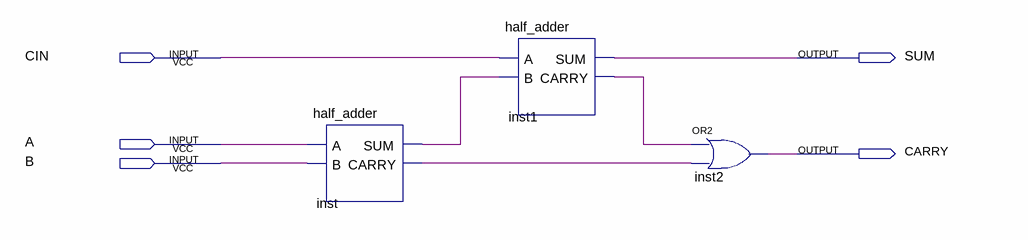
[diagram p0: schematic sheet]
// Quartus schematic full_adder.bdf as structural Verilog: 3 symbols, 5 pins
module full_adder (
  input  CIN,
  input  A,
  input  B,
  output SUM,
  output CARRY
);

  wire inst1_carry, inst_carry, inst_sum;

  half_adder inst (.A(A), .B(B), .SUM(inst_sum), .CARRY(inst_carry));
  half_adder inst1 (.A(CIN), .B(inst_sum), .SUM(SUM), .CARRY(inst1_carry));
  or inst2 (CARRY, inst1_carry, inst_carry);
endmodule
